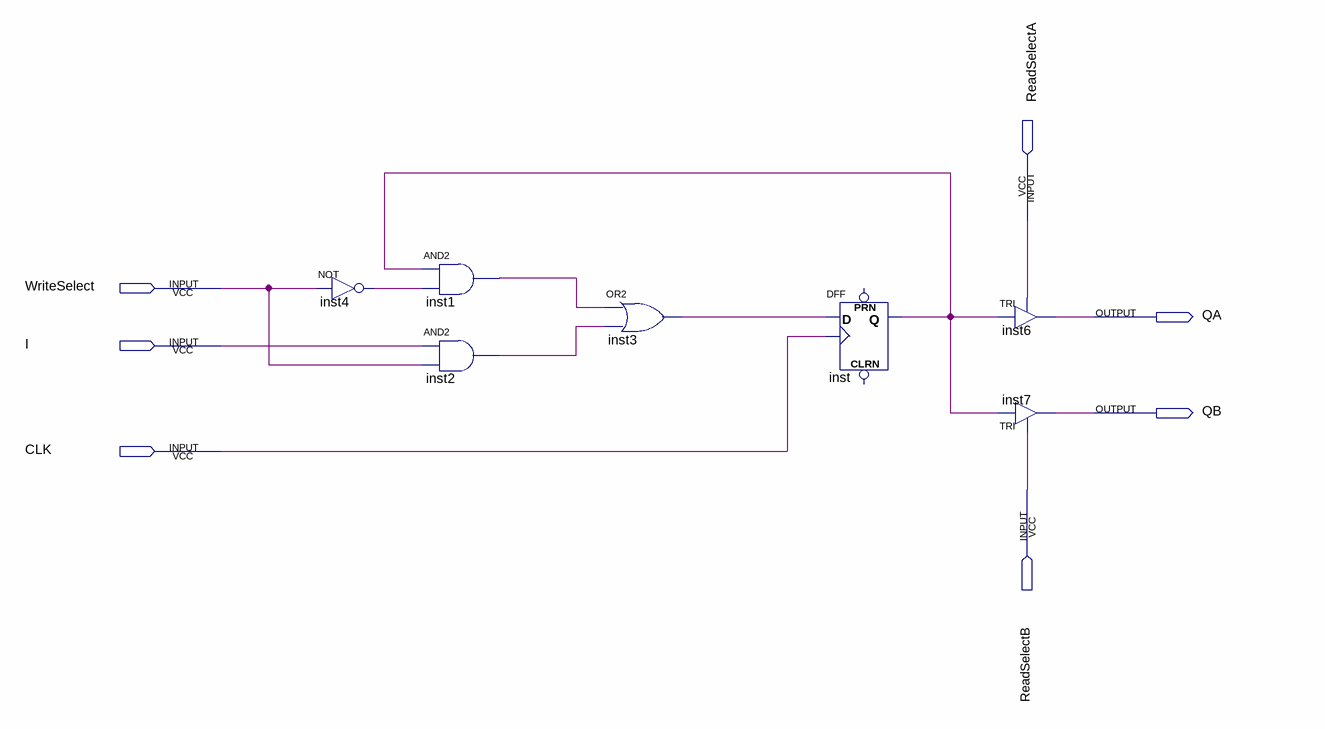
[diagram p0: schematic sheet]
// Quartus schematic ReFi_cell.bdf as structural Verilog: 7 symbols, 7 pins
module ReFi_cell (
  input  ReadSelectA,
  input  WriteSelect,
  input  I,
  input  CLK,
  input  ReadSelectB,
  output QA,
  output QB
);

  wire inst1_out, inst2_out, inst3_out, inst4_out, inst_q;

  not inst4 (inst4_out, WriteSelect);
  and inst1 (inst1_out, inst_q, inst4_out);
  and inst2 (inst2_out, I, WriteSelect);
  or inst3 (inst3_out, inst1_out, inst2_out);
  DFF inst (.CLK(CLK), .D(inst3_out), .Q(inst_q));  // open: CLRN, PRN
  TRI inst6 (.IN(inst_q), .OE(ReadSelectA), .OUT(QA));
  TRI inst7 (.IN(inst_q), .OE(ReadSelectB), .OUT(QB));
endmodule
